# EasyEDA schematic SCH_SOWA-F4-Flight-Controller_2024-07-11.json

## Sheets
1 Scheme_V1.0: TITLE: SOWA F4; REV: 1.0; Date: 2024-05-20; Sheet: 1/1; Drawn By: Bogdan Poplavskyi
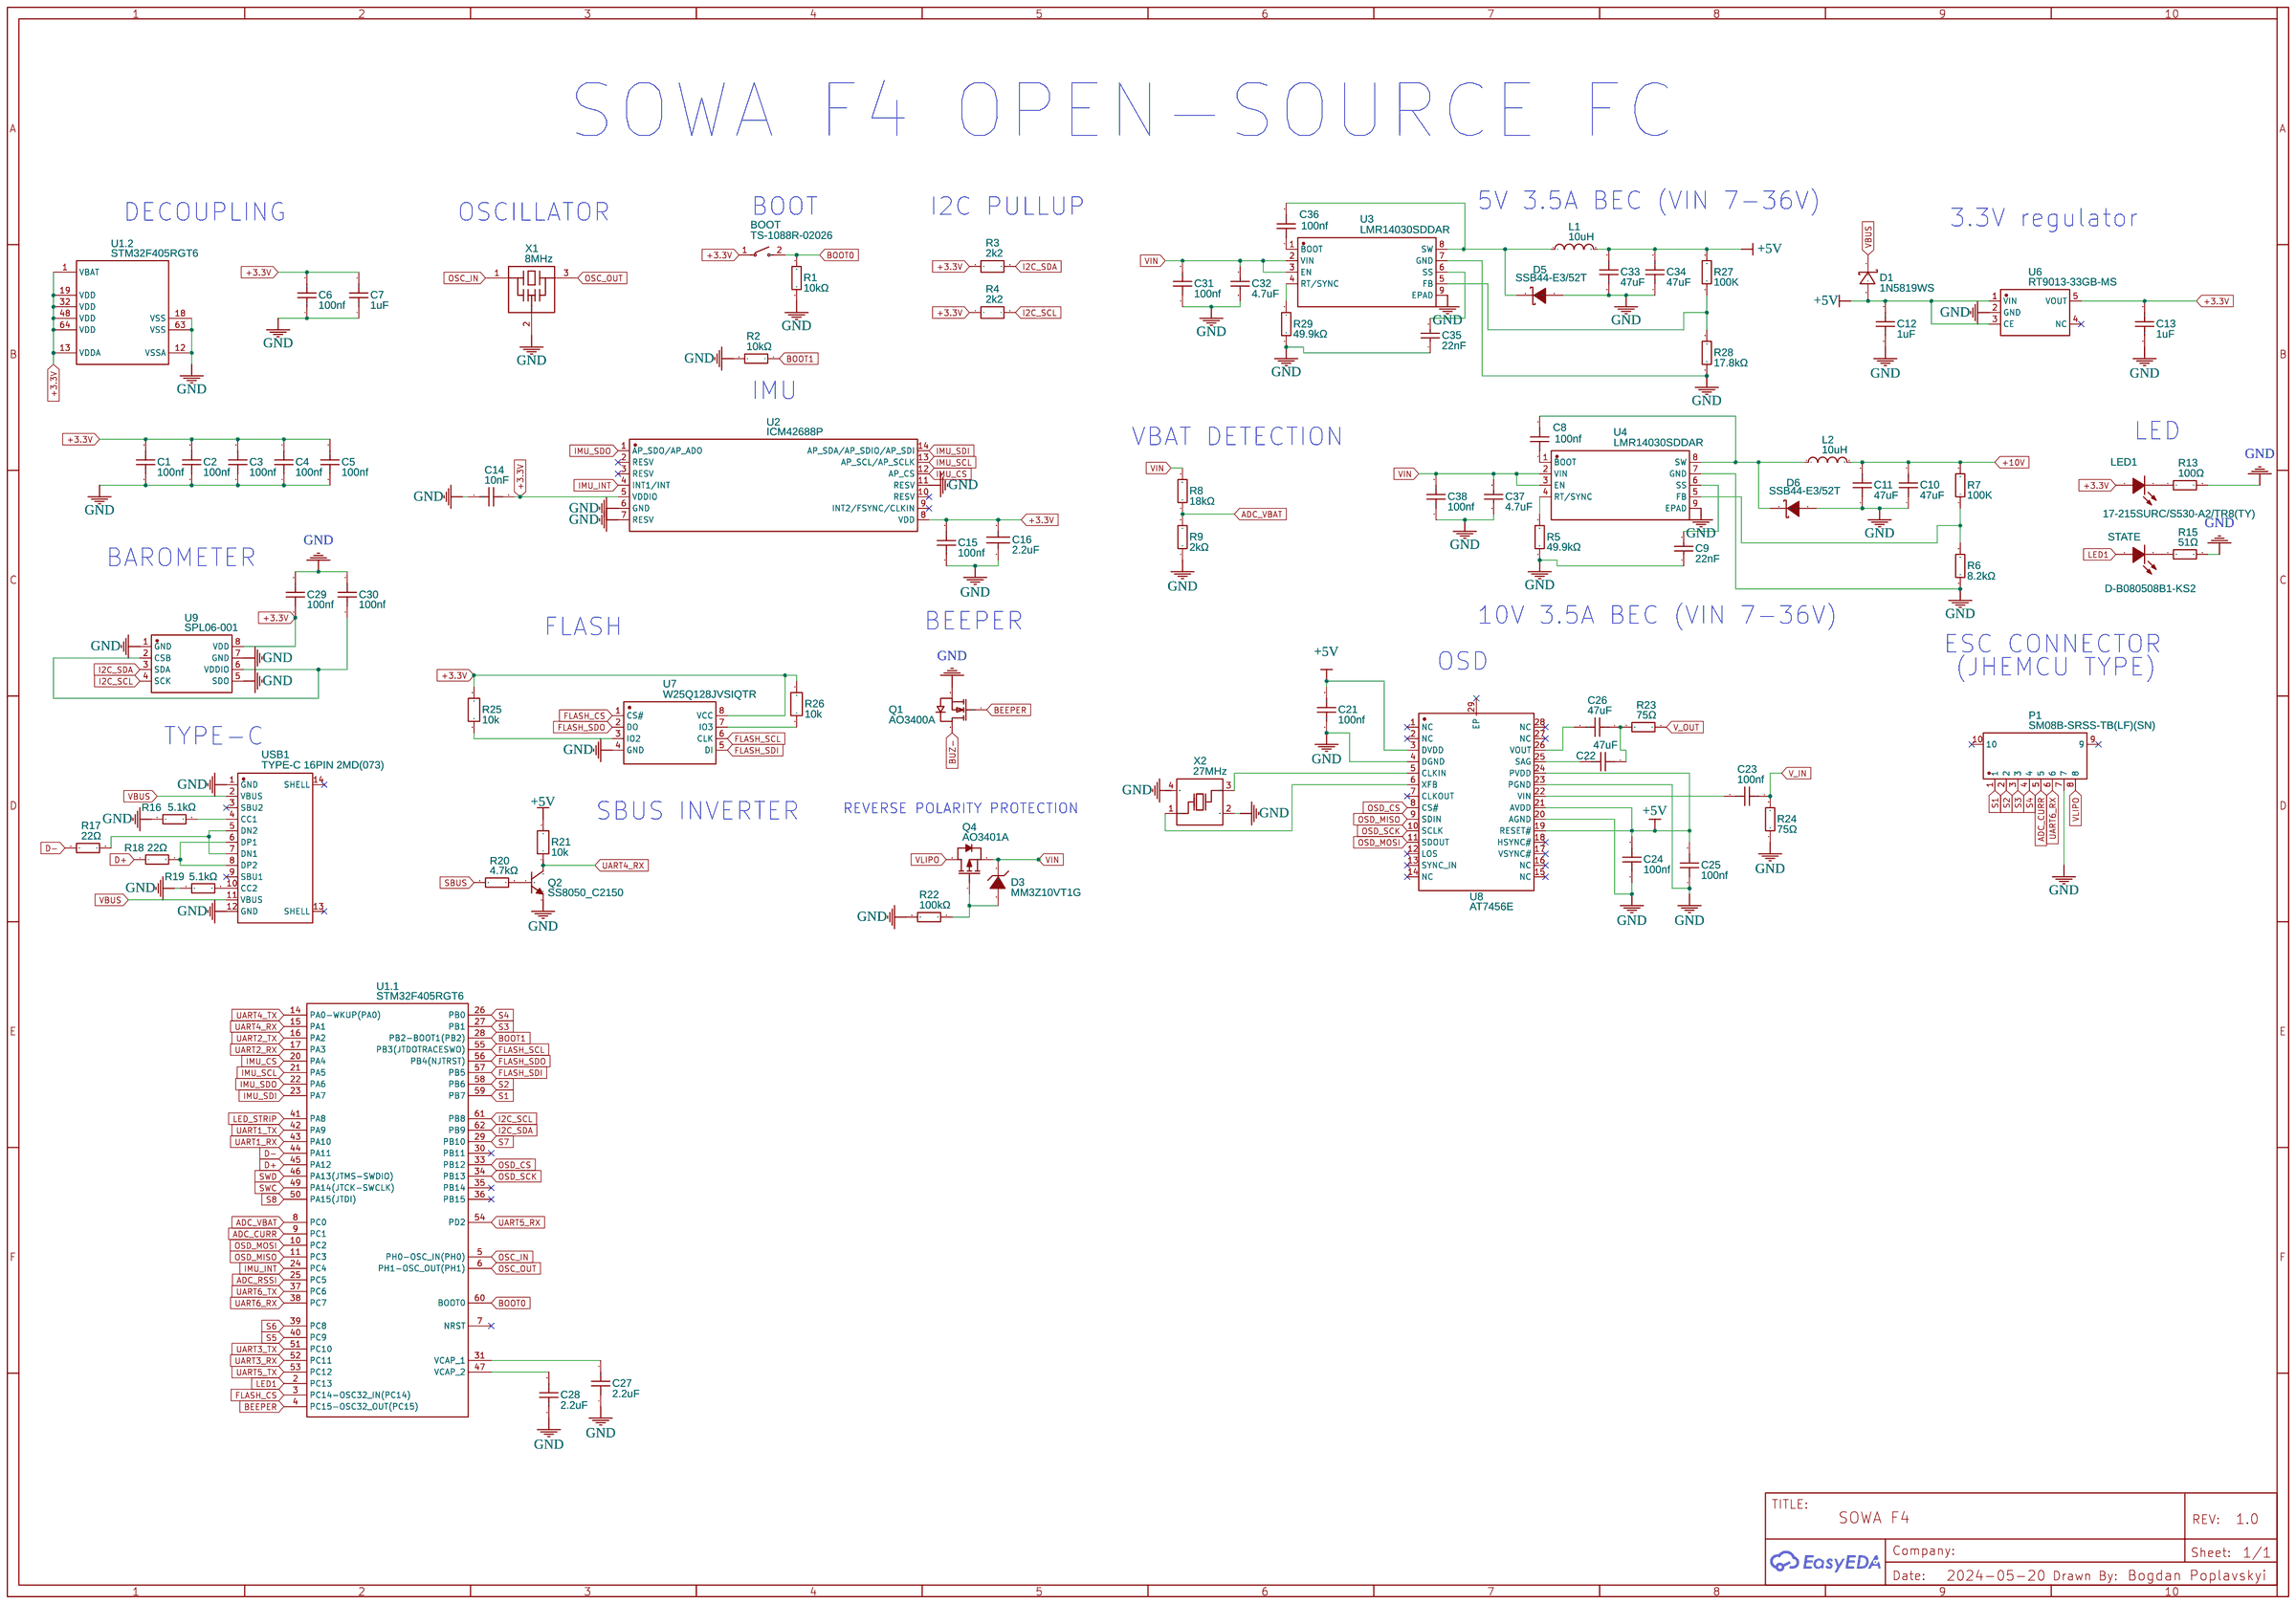
[diagram p0: Scheme_V1.0]
2 Wiring: TITLE: Wiring diagram; Date: 2024-06-30
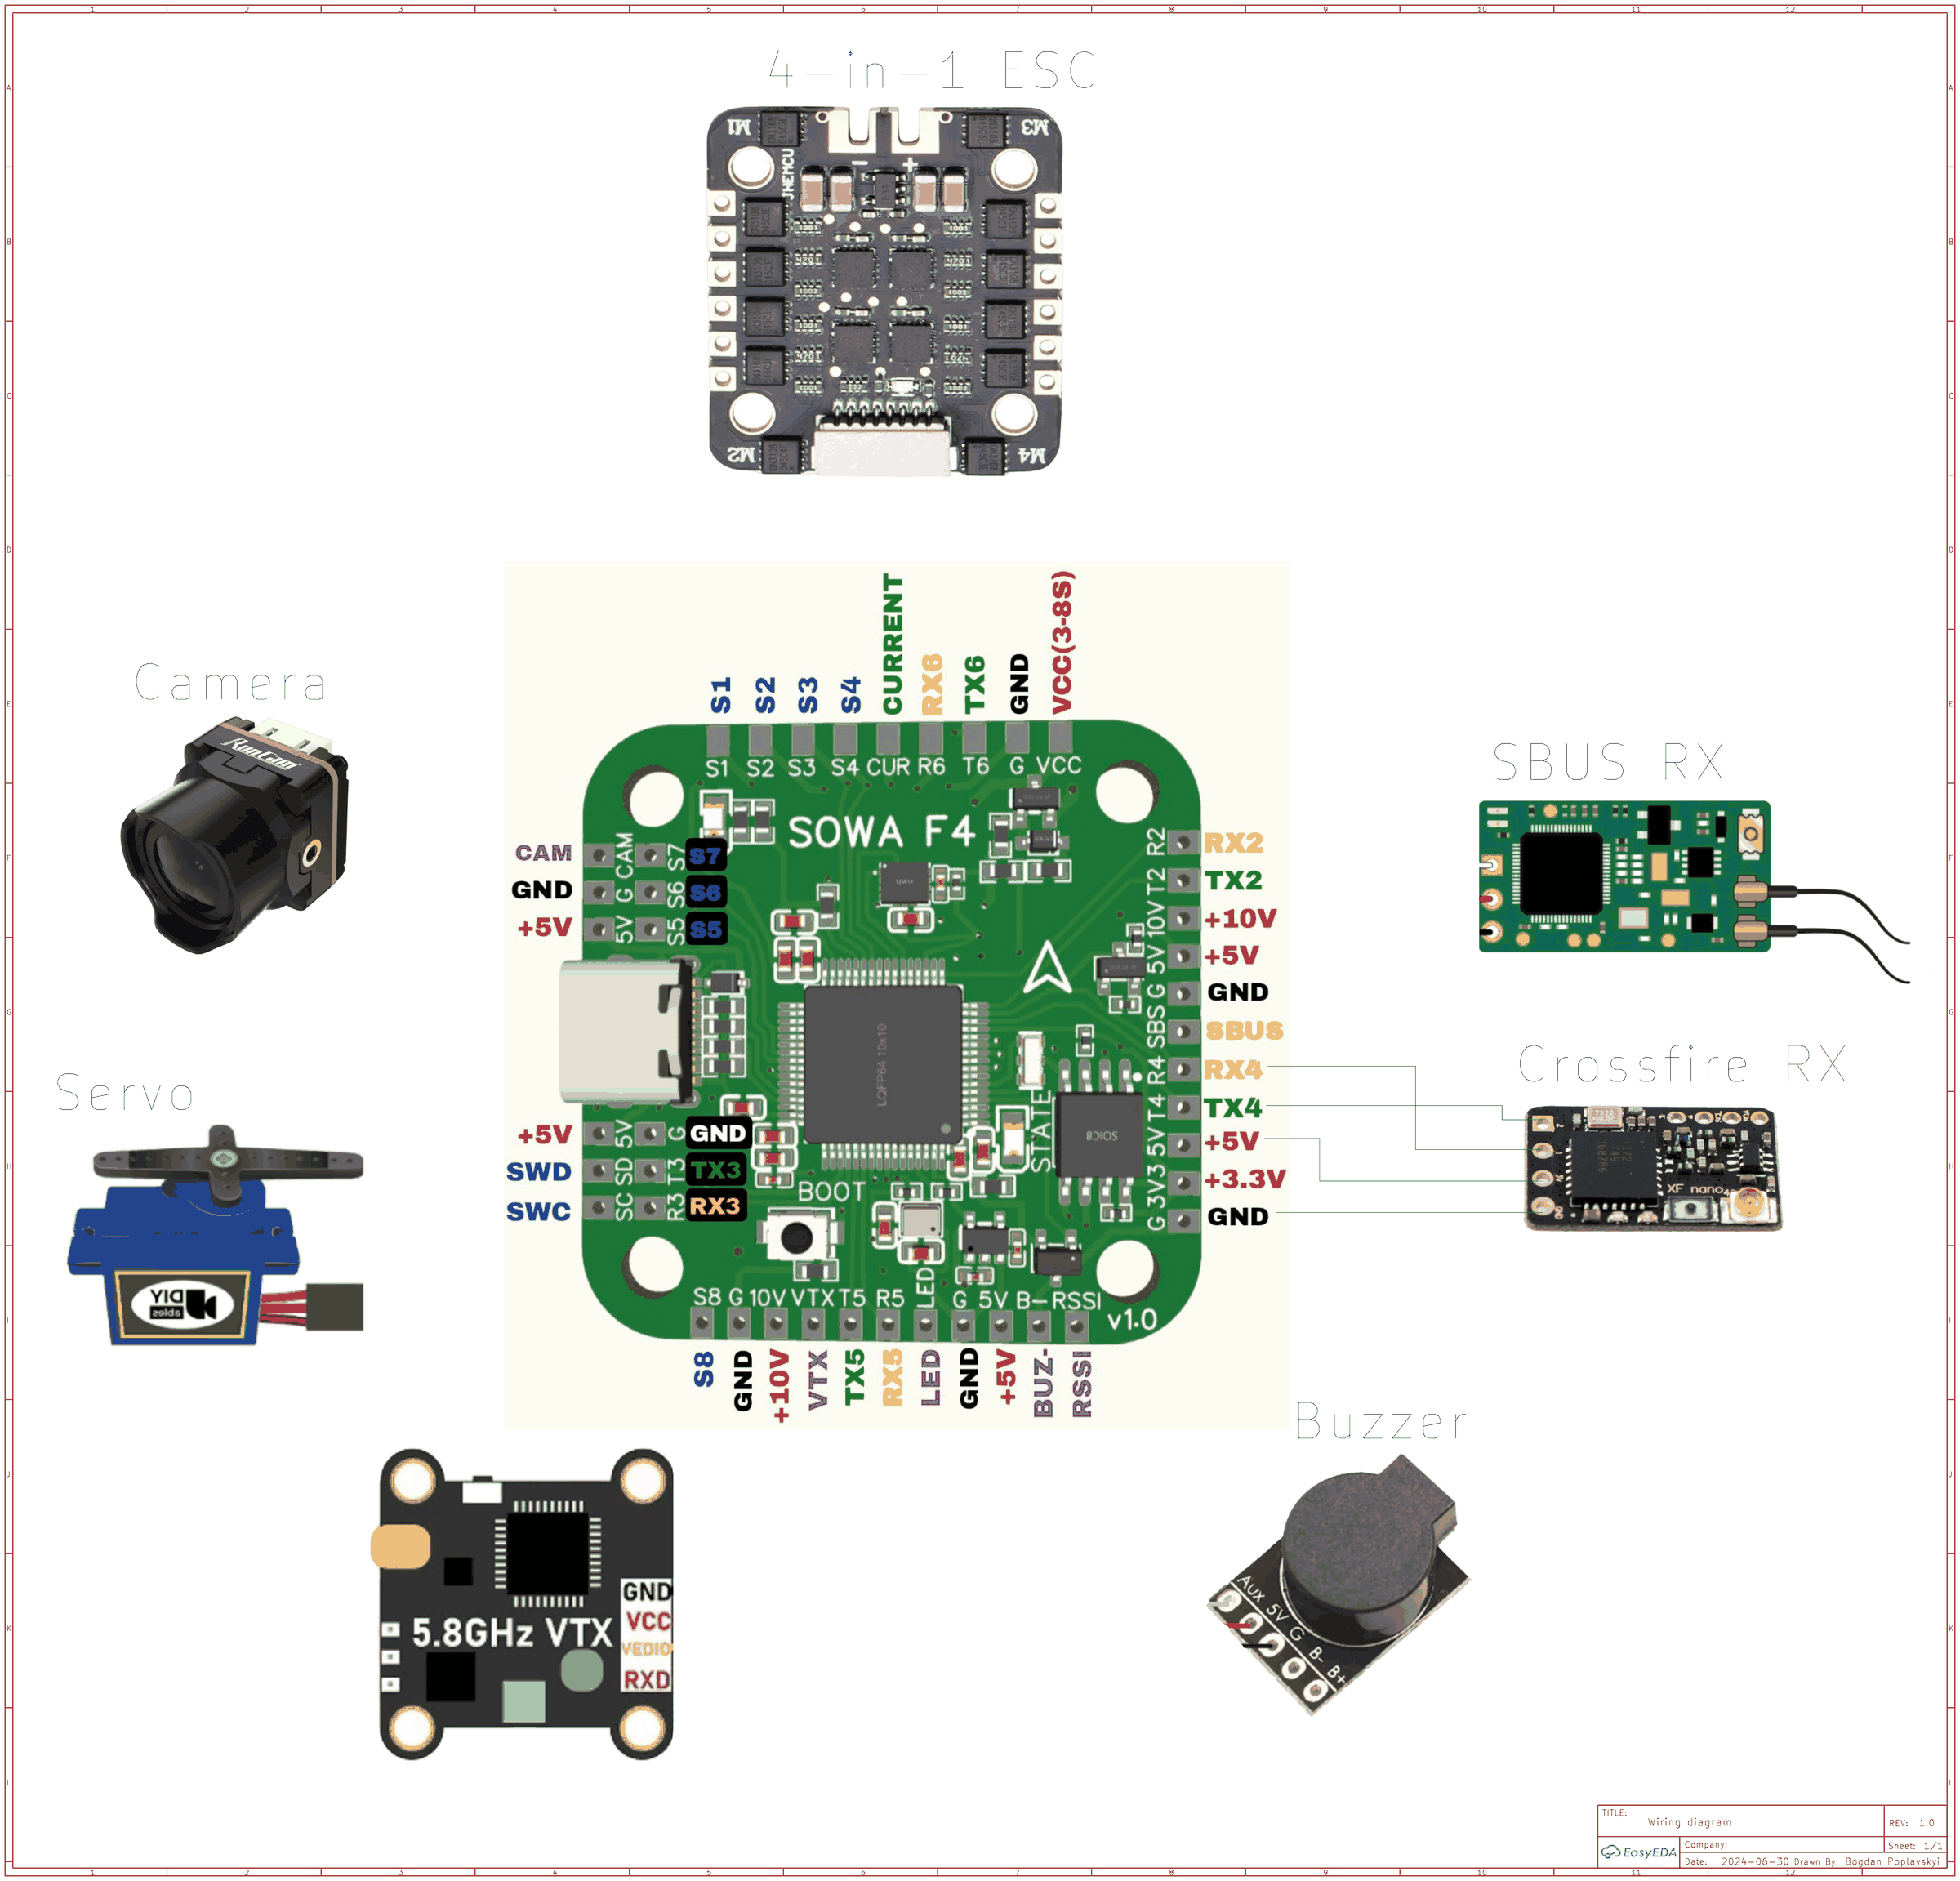
[diagram p1: Wiring]
3 Wiring bottom: TITLE: Wiring diagram; Date: 2024-06-30
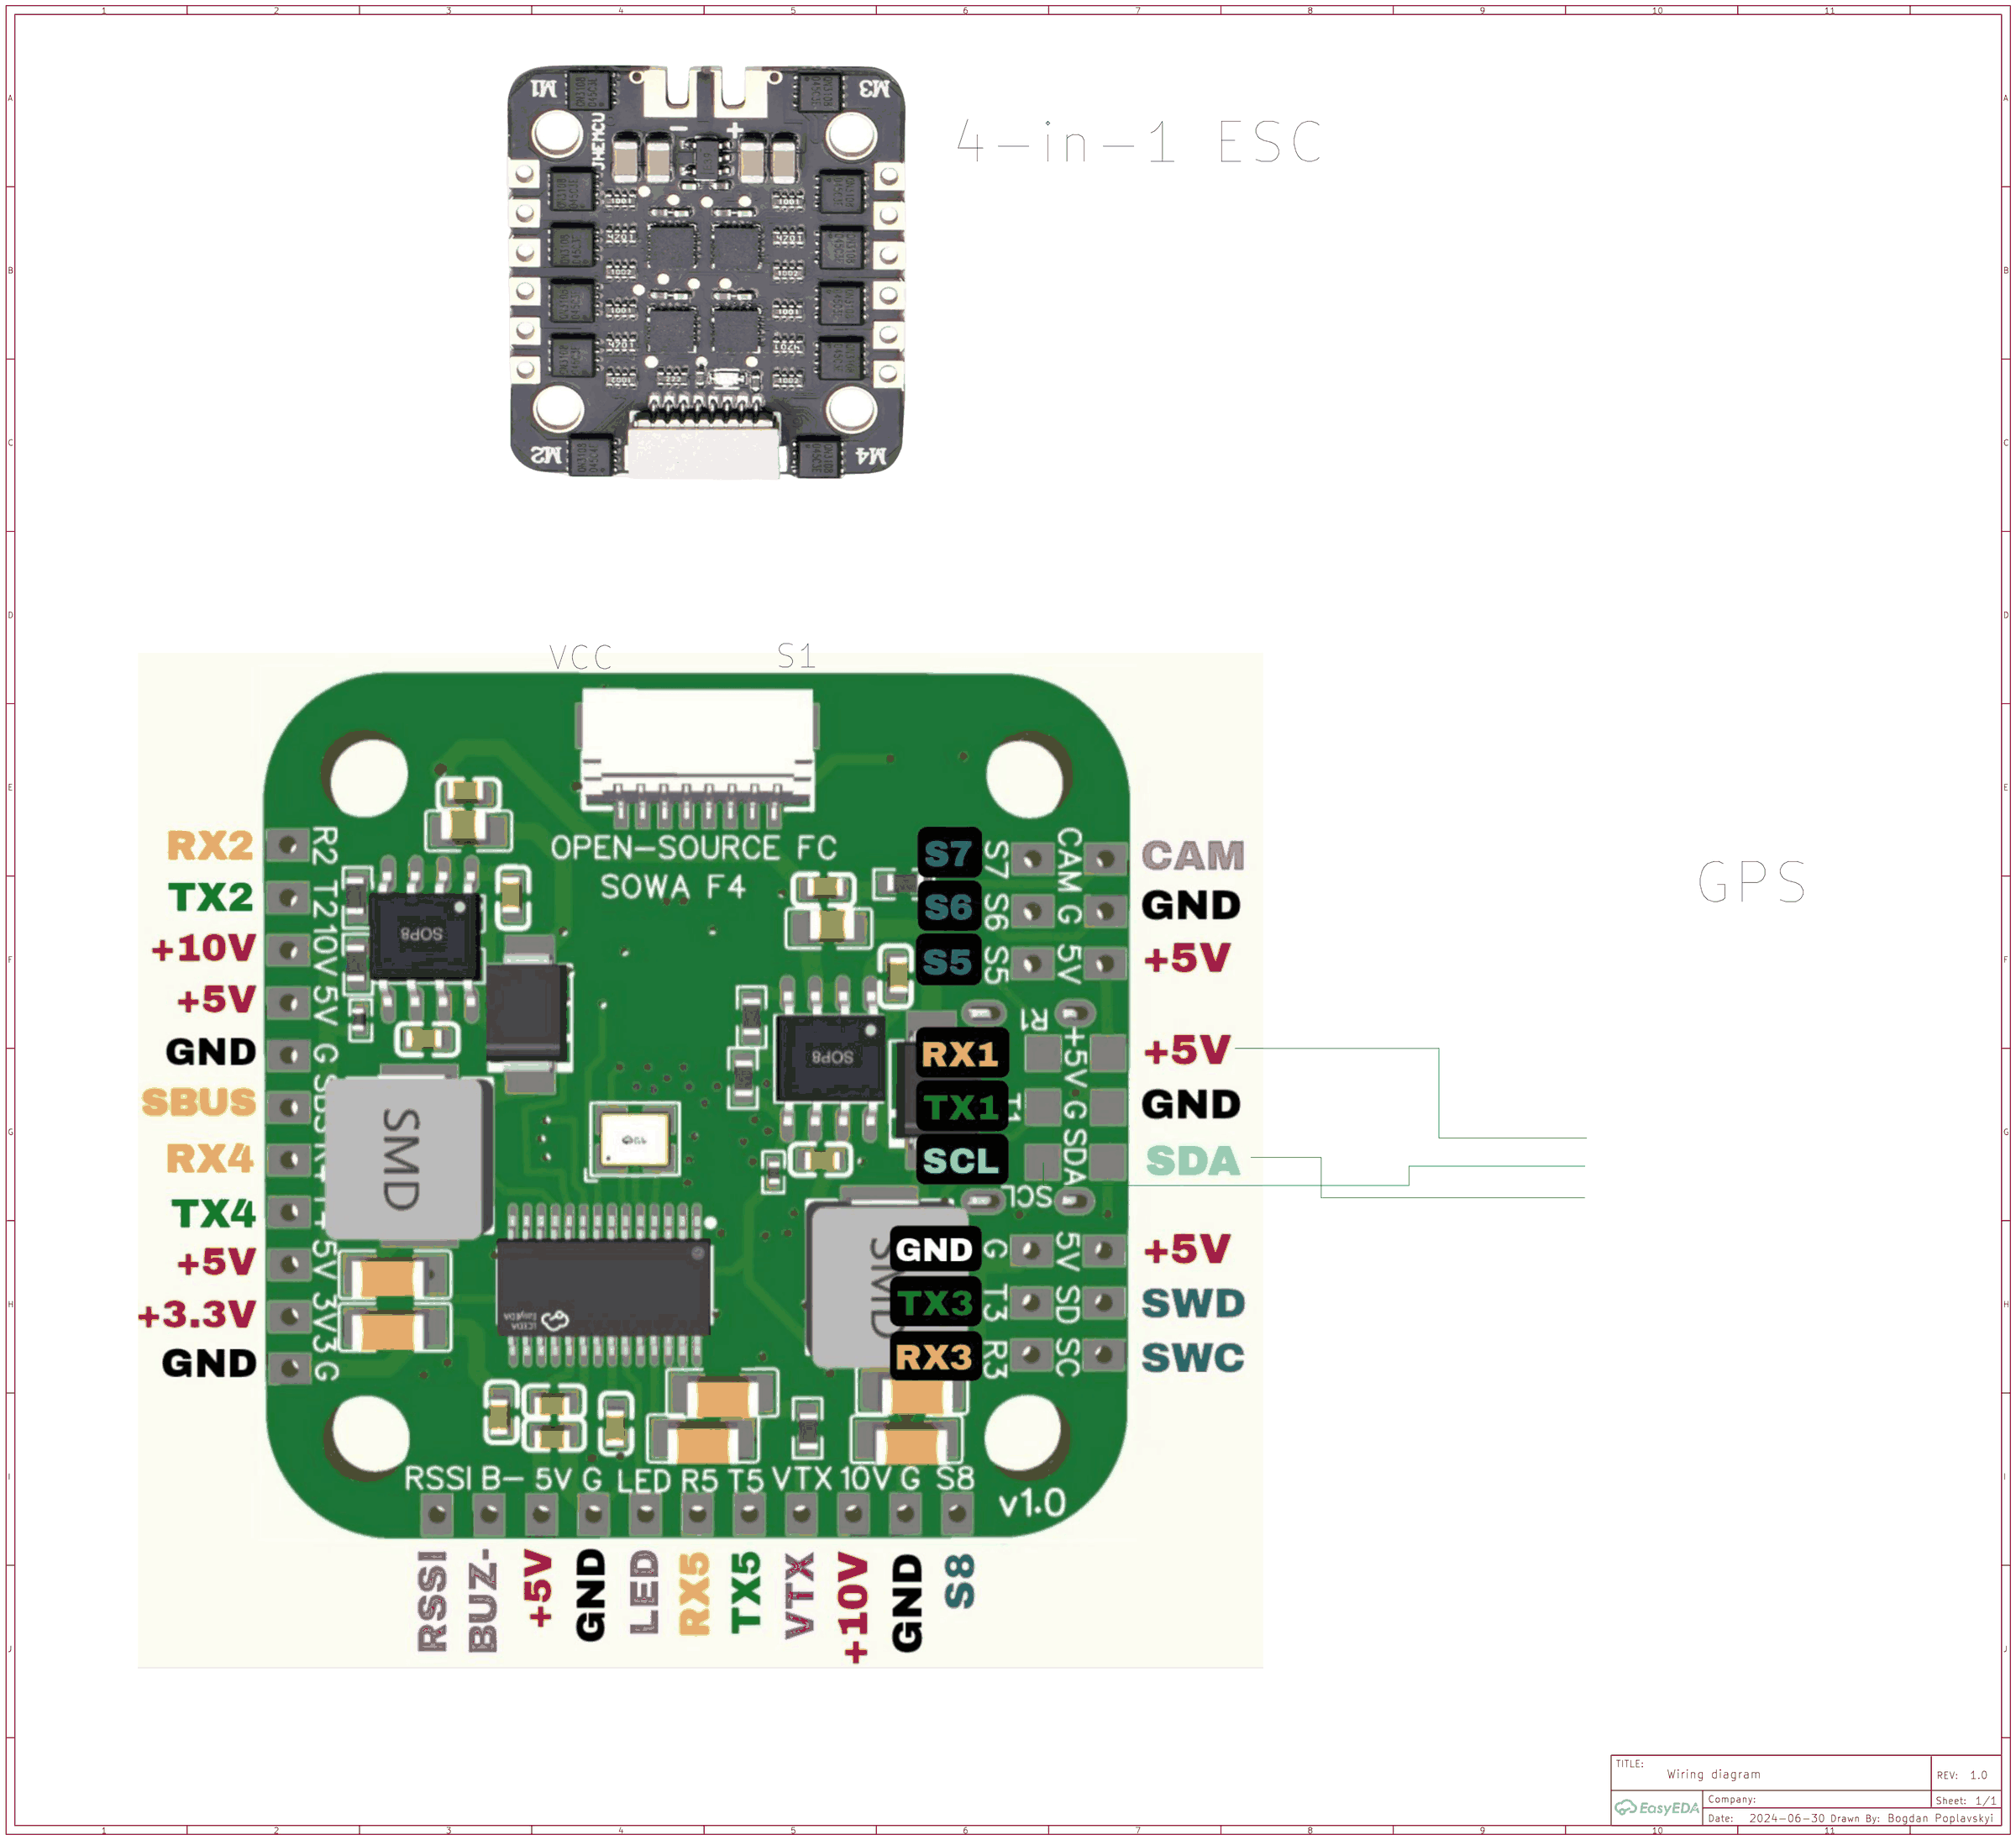
[diagram p2: Wiring bottom]

## Parts
BOOT  TS-1088R-02026  [SW-SMD_L3.9-W3.0-P4.45]
C1  100nf  [C0603]
C2  100nf  [C0603]
C3  100nf  [C0603]
C4  100nf  [C0603]
C5  100nf  [C0603]
C6  100nf  [C0603]
C7  1uF  [C0402]
C8  100nf  [C0603]
C9  22nF  [C0603]
C10  47uF  [C1206]
C11  47uF  [C1206]
C12  1uF  [C0402]
C13  1uF  [C0402]
C14  10nF  [R0402]
C15  100nf  [C0603]
C16  2.2uF  [C0402]
C21  100nf  [C0603]
C22  47uF  [C1206]
C23  100nf  [C0603]
C24  100nf  [C0603]
C25  100nf  [C0603]
C26  47uF  [C1206]
C27  2.2uF  [C0603]
C28  2.2uF  [C0603]
C29  100nf  [C0603]
C30  100nf  [C0603]
C31  100nf  [C0603]
C32  4.7uF  [C0805]
C33  47uF  [C1206]
C34  47uF  [C1206]
C35  22nF  [C0603]
C36  100nf  [C0603]
C37  4.7uF  [C0805]
C38  100nf  [C0603]
D1  1N5819WS  [SOD-323_L1.7-W1.3-LS2.5-FD]
D3  MM3Z10VT1G  [SOD-323_L1.8-W1.3-LS2.5-RD]
D5  SSB44-E3/52T  [SMB_L4.3-W3.6-LS5.4-RD]
D6  SSB44-E3/52T  [SMB_L4.3-W3.6-LS5.4-RD]
L1  10uH  [IND-SMD_L7.3-W6.8]
L2  10uH  [IND-SMD_L7.3-W6.8]
LED1  17-215SURC/S530-A2/TR8(TY)  [LED0805-RD_RED]
P1  SM08B-SRSS-TB(LF)(SN)  [CONN-TH_SM08B-SRSS-TB-LF-SN]
Q1  AO3400A  [SOT-23-3_L2.9-W1.6-P1.90-LS2.8-BR]
Q2  SS8050_C2150  [SOT-23-3_L2.9-W1.3-P1.90-LS2.4-BR]
Q4  AO3401A  [SOT-23_L2.9-W1.3-P1.90-LS2.4-BR]
R1  10kΩ  [R0603]
R2  10kΩ  [R0603]
R3  2k2  [R0402]
R4  2k2  [R0402]
R5  49.9kΩ  [R0603]
R6  8.2kΩ  [R0603]
R7  100K  [R0402]
R8  18kΩ  [R0603]
R9  2kΩ  [R0603]
R13  100Ω  [R0603]
R15  51Ω  [R0603]
R16  5.1kΩ  [R0603]
R17  22Ω  [R0603]
R18  22Ω  [R0603]
R19  5.1kΩ  [R0603]
R20  4.7kΩ  [R0402]
R21  10k  [R0402]
R22  100kΩ  [R0603]
R23  75Ω  [R0603]
R24  75Ω  [R0603]
R25  10k  [R0402]
R26  10k  [R0402]
R27  100K  [R0402]
R28  17.8kΩ  [R0603]
R29  49.9kΩ  [R0603]
STATE  D-B080508B1-KS2  [LED0805-RD]
U1  STM32F405RGT6  [LQFP-64_L10.0-W10.0-P0.50-LS12.0-BL]  (sections 1,2)
U2  ICM42688P  [LGA-14_L3.0-W2.5-P0.50-TL]
U3  LMR14030SDDAR  [SO-8_L4.9-W3.9-P1.27-LS6.0-BL-EP]
U4  LMR14030SDDAR  [SO-8_L4.9-W3.9-P1.27-LS6.0-BL-EP]
U6  RT9013-33GB-MS  [SOT-23-5_L2.9-W1.6-P0.95-LS2.8-BR]
U7  W25Q128JVSIQTR  [SOIC-8_L5.3-W5.3-P1.27-LS8.0-BL]
U8  AT7456E  [HTSSOP-28_L9.7-W4.4-P0.65-LS6.4-BL]
U9  SPL06-001  [SENSOR-SMD_SPL06-001]
USB1  TYPE-C 16PIN 2MD(073)  [USB-C-SMD_TYPE-C-6PIN-2MD-073]
X1  8MHz  [OSC-SMD_3P-L3.2-W1.3-P1.2-L]
X2  27MHz  [OSC-SMD_4P-L3.2-W2.5-BL]

## Library data of the parts
BOOT = TS-1088R-02026: Contributor: LCSC; Supplier: LCSC; Supplier Part: C455280; Manufacturer: XUNPU(讯普); JLCPCB Part Class: Extended Part
C1-C6 C8 C15 C21 C23-C25 C29-C31 C36 C38 = C_0603_US: Supplier Part: C1591; Supplier: LCSC; Contributor: LCEDA_Lib; Manufacturer Part: CL10B104KB8NNNC; Manufacturer: SAMSUNG(三星)
C7 C12 C13 = CGA0805X7R105M500MT: Supplier: LCSC; Supplier Part: C52923; Manufacturer: SAMSUNG(三星); Manufacturer Part: CL05A105KA5NQNC; Contributor: lcsc; JLCPCB Part Class: Extended Part
C9 C35 = CL10B223KB8NNNC: Supplier: LCSC; Manufacturer: SAMSUNG(三星); Supplier Part: C21122; JLCPCB Part Class: Basic Part
C10 C11 C33 C34 = CL31A476MPHNNNE: Supplier: LCSC; Manufacturer: Murata; Manufacturer Part: GRM31CR61E476ME44L; Supplier Part: C403725
C14 = C_0603_US: Supplier Part: C15195; Supplier: LCSC; Contributor: LCEDA_Lib; Manufacturer Part: CL05B103KB5NNNC; Manufacturer: SAMSUNG(三星)
C16 = CL05A225MQ5NSNC: Supplier: LCSC; Manufacturer: SAMSUNG(三星); Supplier Part: C12530; JLCPCB Part Class: Basic Part
C22 C26 = CL31A476MPHNNNE: Supplier: LCSC; Manufacturer: SAMSUNG(三星); Supplier Part: C96123; JLCPCB Part Class: Basic Part
C27 C28 = C_0603_US: Supplier Part: C23630; Supplier: LCSC; Contributor: LCEDA_Lib; Manufacturer Part: CL10A225KO8NNNC; Manufacturer: SAMSUNG(三星)
C32 C37 = CL21A475KBQNNNE: Supplier: LCSC; Manufacturer: SAMSUNG(三星); Supplier Part: C98192; JLCPCB Part Class: Extended Part
D1 = 1N5819WS: Contributor: LCSC; Supplier: LCSC; Supplier Part: C191023; Manufacturer: Hottech(合科泰); JLCPCB Part Class: Basic Part
D3 = MM3Z10VT1G: Supplier: LCSC; Manufacturer: onsemi(安森美); Supplier Part: C39057; JLCPCB Part Class: Extended Part
D5 D6 = SSB44-E3/52T: Contributor: LCSC; Supplier: LCSC; Supplier Part: C466999; Manufacturer: VISHAY(威世); JLCPCB Part Class: Extended Part
L1 L2 = FXL0630-100-M: Contributor: LCSC; Supplier: LCSC; Manufacturer: cjiang(长江微电); Supplier Part: C167223; JLCPCB Part Class: Extended Part
LED1 = 17-215SURC/S530-A2/TR8(TY): Contributor: LCSC; Supplier: LCSC; Manufacturer: EVERLIGHT(亿光); Manufacturer Part: 17-215SURC/S530-A2/TR8; Supplier Part: C142306; JLCPCB Part Class: Extended Part
P1 = SM08B-SRSS-TB(LF)(SN): Contributor: LCSC; Supplier: LCSC; Supplier Part: C160407; Manufacturer: JST; JLCPCB Part Class: Extended Part
Q1 = AO3400A: Supplier: LCSC; Manufacturer: AOS; Supplier Part: C20917; JLCPCB Part Class: Basic Part
Q2 = SS8050_C2150: Supplier: LCSC; Manufacturer: CJ(江苏长电/长晶); Manufacturer Part: SS8050; Supplier Part: C2150; JLCPCB Part Class: Basic Part
Q4 = AO3401A: Supplier: LCSC; Manufacturer: AOS; Supplier Part: C15127; JLCPCB Part Class: Basic Part
R1 R2 = 0603WAF1002T5E: Supplier: LCSC; Manufacturer: UNI-ROYAL(厚声); Supplier Part: C25804; JLCPCB Part Class: Basic Part
R3 R4 = R_0603_EU: Supplier Part: C25879; Supplier: LCSC; Contributor: LCEDA_Lib; Manufacturer Part: 0402WGF2201TCE; Manufacturer: UNI-ROYAL(厚声)
R5 R29 = 0603WAF4992T5E: Supplier: LCSC; Manufacturer: UNI-ROYAL(厚声); Supplier Part: C23184; JLCPCB Part Class: Basic Part
R6 = 0603WAF8201T5E: Supplier: LCSC; Manufacturer: UNI-ROYAL(厚声); Supplier Part: C25981; JLCPCB Part Class: Basic Part
R7 R27 = 0402WGF1003TCE: Supplier: LCSC; Manufacturer: UNI-ROYAL; Supplier Part: C25741
R8 = 0603WAF1802T5E: Supplier: LCSC; Manufacturer: UNI-ROYAL(厚声); Supplier Part: C25810; JLCPCB Part Class: Basic Part
R9 = 0603WAF2001T5E: Supplier: LCSC; Manufacturer: UNI-ROYAL(厚声); Supplier Part: C22975; JLCPCB Part Class: Basic Part
R13 = 0603WAF1000T5E: Supplier: LCSC; Manufacturer: UNI-ROYAL(厚声); Supplier Part: C22775; JLCPCB Part Class: Basic Part
R15 = 0603WAJ0510T5E: Supplier: LCSC; Manufacturer: UNI-ROYAL(厚声); Supplier Part: C25246; JLCPCB Part Class: Extended Part
R16 R19 = 0603WAF5101T5E: Supplier: LCSC; Manufacturer: UNI-ROYAL(厚声); Supplier Part: C23186; JLCPCB Part Class: Basic Part
R17 R18 = 0603WAF220JT5E: Supplier: LCSC; Manufacturer: UNI-ROYAL(厚声); Supplier Part: C23345; JLCPCB Part Class: Basic Part
R20 = 0402WGF4701TCE: Supplier: LCSC; Manufacturer: UNI-ROYAL(厚声); Supplier Part: C25900; JLCPCB Part Class: Basic Part
R21 R25 R26 = R_0603_EU: Supplier Part: C25744; Supplier: LCSC; Contributor: LCEDA_Lib; Manufacturer Part: 0402WGF1002TCE; Manufacturer: UNI-ROYAL(厚声)
R22 = 0603WAF1003T5E: Supplier: LCSC; Manufacturer: UNI-ROYAL(厚声); Supplier Part: C25803; JLCPCB Part Class: Basic Part
R23 R24 = 0603WAF750JT5E: Supplier: LCSC; Manufacturer: UNI-ROYAL(厚声); Supplier Part: C4275; JLCPCB Part Class: Basic Part
R28 = RC0603FR-0717K8L: Contributor: LCSC; Supplier: LCSC; Supplier Part: C185364; Manufacturer: YAGEO(国巨); JLCPCB Part Class: Extended Part
STATE = D-B080508B1-KS2: Contributor: LCSC; Supplier: LCSC; Manufacturer: ARKLED(方舟); Supplier Part: C108412; JLCPCB Part Class: Extended Part
U1 = STM32F405RGT6: tags: STM32; subpart_no: 1; image: http://image.lceda.cn/szlcsc/C15742.jpg; Supplier Part: C15742; Supplier: LCSC; Manufacturer: ST(意法半导体); JLCPCB Part Class: Extended Part
U2 = ICM42688P: Supplier: LCSC; Supplier Part: C1850418; Manufacturer: TDK InvenSense(应美盛); Manufacturer Part: ICM-42688-P; Contributor: lcsc; JLCPCB Part Class: Extended Part
U3 U4 = LMR14030SDDAR: Contributor: LCSC; Supplier: LCSC; Supplier Part: C182078; Manufacturer: TI(德州仪器); JLCPCB Part Class: Extended Part
U6 = RT9013-33GB-MS: Contributor: lcsc; Supplier: LCSC; Supplier Part: C7434207; Manufacturer: MSKSEMI(美森科); JLCPCB Part Class: Extended Part
U7 = W25Q128JVSIQTR: Supplier: LCSC; Manufacturer: WINBOND(华邦); Manufacturer Part: W25Q128JVSIQ; Supplier Part: C97521; JLCPCB Part Class: Basic Part
U8 = AT7456E: Supplier: LCSC; Manufacturer: 杭州中科微; Supplier Part: C82351; JLCPCB Part Class: Extended Part
U9 = SPL06-001: Contributor: LCSC; Supplier: LCSC; Supplier Part: C2684428; Manufacturer: Goertek(歌尔); JLCPCB Part Class: Extended Part
USB1 = TYPE-C 16PIN 2MD(073): Contributor: LCSC; Supplier: LCSC; Supplier Part: C2765186; Manufacturer: SHOU HAN(首韩); JLCPCB Part Class: Extended Part
X1 = CSTCE8M00G55-R0: Supplier: LCSC; Manufacturer: muRata(村田); Supplier Part: C70457; JLCPCB Part Class: Extended Part
X2 = SMD-3225_4P27MHZ12PF10PPM-40&#126;+85℃: Contributor: LCSC; Supplier: LCSC; Supplier Part: C164057; Manufacturer: YJX(雅晶鑫); Manufacturer Part: TAXM27M4RFBCCT2T; JLCPCB Part Class: Extended Part

## Nets
+3.3V: BOOT.1 C1.2 C2.2 C3.2 C4.2 C5.2 C6.2 C7.2 C13.2 C14.2 C15.2 C16.2 C29.1 LED1.2(A) R3.1 R4.1 R25.2 R26.2 U1.1(VBAT) U1.13(VDDA) U1.19(VDD) U1.32(VDD) U1.48(VDD) U1.64(VDD) U2.5(VDDIO) U2.8(VDD) U6.5(VOUT) U7.8(VCC) U9.8(VDD)
+5V: C12.2 C21.2 C24.2 C25.2 C33.2 C34.2 D1.2(A) L1.2 R21.2 R27.2 U6.1(VIN) U6.3(CE) U8.3(DVDD) U8.19(RESET#) U8.21(AVDD) U8.24(PVDD)
+10V: C10.2 C11.2 L2.2 R7.2
GND: C1.1 C2.1 C3.1 C4.1 C5.1 C6.1 C7.1 C9.1 C10.1 C11.1 C12.1 C13.1 C14.1 C15.1 C16.1 C21.1 C24.1 C25.1 C27.1 C28.1 C29.2 C30.2 C31.1 C32.1 C33.1 C34.1 C35.1 C37.1 C38.1 D5.2(A) D6.2(A) P1.7 Q1.2(S) Q2.2(E) R1.1 R2.2 R5.1 R6.1 R9.1 R13.2 R15.2 R16.1 R19.1 R22.2 R24.1 R28.1 R29.1 U1.12(VSSA) U1.18(VSS) U1.63(VSS) U2.6(GND) U2.7(RESV) U2.11(RESV) U3.7(GND) U3.9(EPAD) U4.7(GND) U4.9(EPAD) U6.2(GND) U7.4(GND) U8.4(DGND) U8.20(AGND) U8.23(PGND) U9.1(GND) U9.5(SDO) U9.7(GND) USB1.1(GND) USB1.12(GND) X1.2(VSS) X2.2(GND) X2.4(GND)
VBUS: D1.1(K) USB1.2(VBUS) USB1.11(VBUS)
VIN: C31.2 C32.2 C37.2 C38.2 D3.1(C) Q4.2(S) R8.2 U3.2(VIN) U3.3(EN) U4.2(VIN) U4.3(EN)
ADC_CURR: P1.5 U1.9(PC1)
ADC_RSSI: U1.25(PC5)
ADC_VBAT: R8.1 R9.2 U1.8(PC0)
BEEPER: Q1.1(G) U1.4(PC15-OSC32_OUT(PC15))
BOOT0: BOOT.2 R1.2 U1.60(BOOT0)
BOOT1: R2.1 U1.28(PB2-BOOT1(PB2))
BUZ-: Q1.3(D)
D+: R18.1 U1.45(PA12)
D-: R17.1 U1.44(PA11)
FLASH_CS: U1.3(PC14-OSC32_IN(PC14)) U7.1(CS#)
FLASH_SCL: U1.55(PB3(JTDOTRACESWO)) U7.6(CLK)
FLASH_SDI: U1.57(PB5) U7.5(DI)
FLASH_SDO: U1.56(PB4(NJTRST)) U7.2(DO)
I2C_SCL: R4.2 U1.61(PB8) U9.4(SCK)
I2C_SDA: R3.2 U1.62(PB9) U9.3(SDA)
IMU_CS: U1.20(PA4) U2.12(AP_CS)
IMU_INT: U1.24(PC4) U2.4(INT1/INT)
IMU_SCL: U1.21(PA5) U2.13(AP_SCL/AP_SCLK)
IMU_SDI: U1.23(PA7) U2.14(AP_SDA/AP_SDIO/AP_SDI)
IMU_SDO: U1.22(PA6) U2.1(AP_SDO/AP_ADO)
LED1: STATE.2(A) U1.2(PC13)
LED_STRIP: U1.41(PA8)
OSC_IN: U1.5(PH0-OSC_IN(PH0)) X1.1
OSC_OUT: U1.6(PH1-OSC_OUT(PH1)) X1.3
OSD_CS: U1.33(PB12) U8.8(CS#)
OSD_MISO: U1.11(PC3) U8.9(SDIN)
OSD_MOSI: U1.10(PC2) U8.11(SDOUT)
OSD_SCK: U1.34(PB13) U8.10(SCLK)
S1: P1.1 U1.59(PB7)
S2: P1.2 U1.58(PB6)
S3: P1.3 U1.27(PB1)
S4: P1.4 U1.26(PB0)
S5: U1.40(PC9)
S6: U1.39(PC8)
S7: U1.29(PB10)
S8: U1.50(PA15(JTDI))
SBUS: R20.1
SWC: U1.49(PA14(JTCK-SWCLK))
SWD: U1.46(PA13(JTMS-SWDIO))
UART1_RX: U1.43(PA10)
UART1_TX: U1.42(PA9)
UART2_RX: U1.17(PA3)
UART2_TX: U1.16(PA2)
UART3_RX: U1.52(PC11)
UART3_TX: U1.51(PC10)
UART4_RX: Q2.3(C) R21.1 U1.15(PA1)
UART4_TX: U1.14(PA0-WKUP(PA0))
UART5_RX: U1.54(PD2)
UART5_TX: U1.53(PC12)
UART6_RX: P1.6 U1.38(PC7)
UART6_TX: U1.37(PC6)
V_IN: C23.1 R24.2
V_OUT: R23.2
VLIPO: P1.8 Q4.3(D)
Net-(C8-1): C8.1 U4.1(BOOT)
Net-(C8-2): C8.2 D6.1(C) L2.1 U4.8(SW)
Net-(C9-2): C9.2 U4.6(SS)
Net-(C22-1): C22.1 C26.1 R23.1
Net-(C22-2): C22.2 U8.25(SAG)
Net-(C23-2): C23.2 U8.22(VIN)
Net-(C26-2): C26.2 U8.26(VOUT)
Net-(C27-2): C27.2 U1.31(VCAP_1)
Net-(C28-2): C28.2 U1.47(VCAP_2)
Net-(C30-1): C30.1 U9.2(CSB) U9.6(VDDIO)
Net-(C35-2): C35.2 U3.6(SS)
Net-(C36-1): C36.1 U3.1(BOOT)
Net-(C36-2): C36.2 D5.1(C) L1.1 U3.8(SW)
Net-(D3-2): D3.2(A) Q4.1(G) R22.1
Net-(LED1-1): LED1.1(K) R13.1
Net-(Q2-1): Q2.1(B) R20.2
Net-(R5-2): R5.2 U4.4(RT/SYNC)
Net-(R6-2): R6.2 R7.1 U4.5(FB)
Net-(R15-1): R15.1 STATE.1(K)
Net-(R16-2): R16.2 USB1.4(CC1)
Net-(R17-2): R17.2 USB1.5(DN2) USB1.7(DN1)
Net-(R18-2): R18.2 USB1.6(DP1) USB1.8(DP2)
Net-(R19-2): R19.2 USB1.10(CC2)
Net-(R25-1): R25.1 U7.3(IO2)
Net-(R26-1): R26.1 U7.7(IO3)
Net-(R27-1): R27.1 R28.2 U3.5(FB)
Net-(R29-2): R29.2 U3.4(RT/SYNC)
Net-(U8-5): U8.5(CLKIN) X2.3(OSC2)
Net-(U8-6): U8.6(XFB) X2.1(OSC1)

Not connected (* = marked no-connect by the designer): P1 9* 10*; U1 7(NRST)* 30(PB11)* 35(PB14)* 36(PB15)*; U2 2(RESV)* 3(RESV)* 9(INT2/FSYNC/CLKIN)* 10(RESV)*; U6 4(NC)*; U8 1(NC)* 2(NC)* 7(CLKOUT)* 12(LOS)* 13(SYNC_IN)* 14(NC)* 15(NC)* 16(NC)* 17(VSYNC#)* 18(HSYNC#)* 27(NC)* 28(NC)* 29(EP)*; USB1 3(SBU2)* 9(SBU1)* 13(SHELL)* 14(SHELL)*

## Notes on the sheets
sheet 1
- SOWA F4 OPEN-SOURCE FC
- DECOUPLING
- OSCILLATOR
- BOOT
- I2C PULLUP
- 5V 3.5A BEC (VIN 7-36V)
- 3.3V regulator
- IMU
- LED
- VBAT DETECTION
- BAROMETER
- BEEPER
- 10V 3.5A BEC (VIN 7-36V)
- FLASH
- ESC CONNECTOR
- OSD
- (JHEMCU TYPE)
- TYPE-C
- SBUS INVERTER
- REVERSE POLARITY PROTECTION
sheet 2
- 4-in-1 ESC
- Camera
- SBUS RX
- Crossfire RX
- Servo
- Buzzer
sheet 3
- 4-in-1 ESC
- S1
- VCC
- GPS
